# Altium schematic sheet Sheet2.SchDoc
size A; DocumentNumber: 8; SheetNumber: 9; SheetTotal: 9
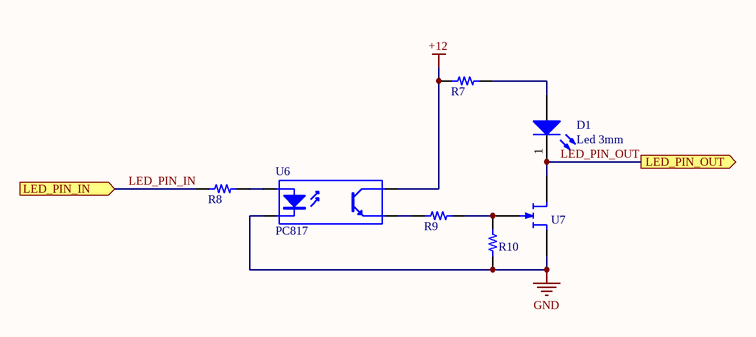
[diagram p0: Sheet2.SchDoc]

## Parts
D1  Led 3mm  [LED-3mm]
R7  1K  [SMD 0805 RES]  (value not drawn)
R8  1K  [SMD 0805 RES]  (value not drawn)
R9  1K  [SMD 0805 RES]  (value not drawn)
R10  1K  [SMD 0805 RES]  (value not drawn)
U6  PC817  [OPTOISOLATOR]
U7  SMD N-MOSFET  [DPAK228P991X238-3N]  (value not drawn)

## Ports
LED_PIN_IN (in), LED_PIN_OUT (out)

## Nets
+12: R7.1 U6.4(C)
GND: R10.1 U6.2(K) U7.3(S)
LED_PIN_IN: R8.1 ; port LED_PIN_IN
LED_PIN_OUT: D1.1(CATHODE) U7.1(D) ; port LED_PIN_OUT
NetD1_2: D1.2(ANODE) R7.2
NetR8_2: R8.2 U6.1(A)
NetR9_1: R9.1 U6.3(E)
NetR9_2: R9.2 R10.2 U7.2(G)

## Library data of the parts
D1 = LED1: 3 mm color LED illumination 14000~15000 mcd , High brightness and long life time with wide rand of operations.; Published: 8-Jun-2000; LatestRevisionDate: 08-Jul-2005; LatestRevisionNote: Mech Layer 1 removed.; PackageReference: LED-1; Publisher: Altium Limited; PackageDescription: LED; 2 Leads
R7-R10 = RESISTOR